# EasyEDA Pro project ProPrj_ATC PTT v1_2026-08-08.epro

# Schematic Schematic1
Board Name: Board1; Create Date: 2026-07-08; Page Name: P1; Project Name: ATC PTT v1; Schematic Name: Schematic1; Update Date: 2026-07-08; Company: EasyEDA.com; Page Size: A4; Version: V1.0
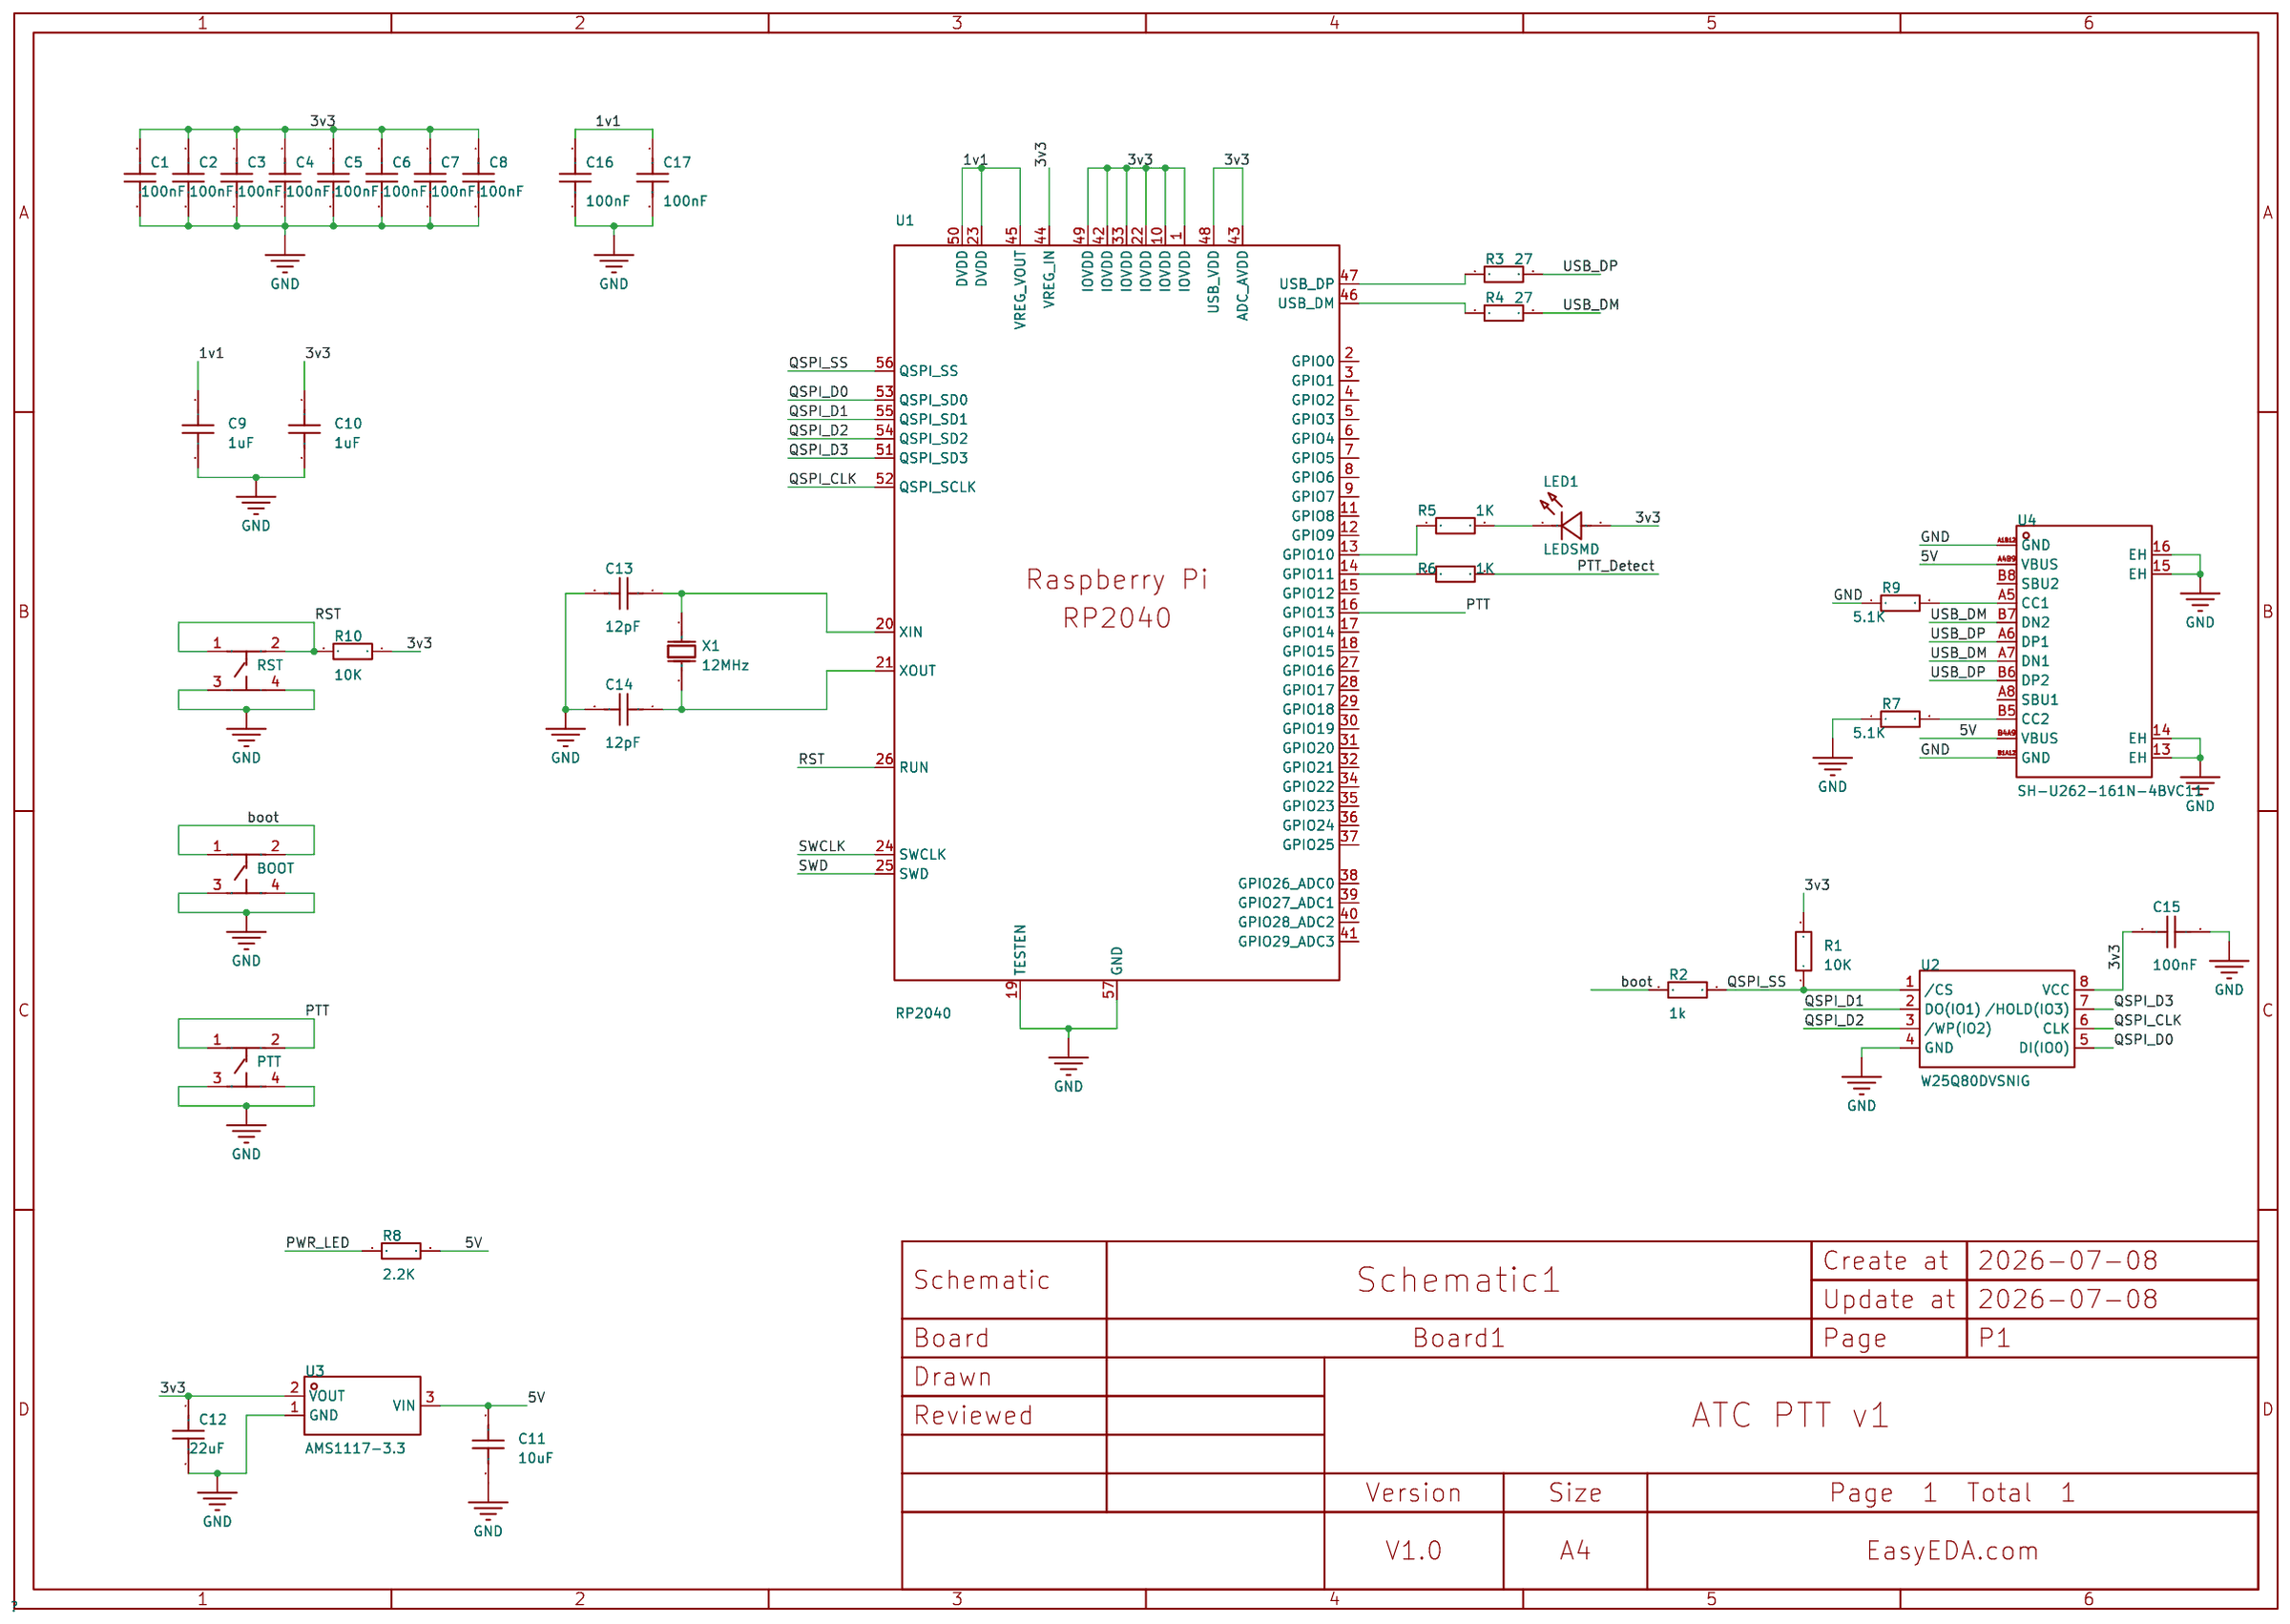
[diagram p0: schematic sheet]

## Parts
BOOT  TSD003B06018A03  [SW-SMD_4P-L6.0-W6.0-P4.50-LS8.6]
C1  100nF  [C0805]
C2  100nF  [C0805]
C3  100nF  [C0805]
C4  100nF  [C0805]
C5  100nF  [C0805]
C6  100nF  [C0805]
C7  100nF  [C0805]
C8  100nF  [C0805]
C9  1uF  [C0805]
C10  1uF  [C0805]
C11  10uF  [C0805]
C12  22uF  [C0805]
C13  12pF  [C0805]
C14  12pF  [C0805]
C15  100nF  [C0805]
C16  100nF  [C0805]
C17  100nF  [C0805]
LED1  LEDSMD  [LED0805-RD_YELLOW]
PTT  TSD003B06018A03  [SW-SMD_4P-L6.0-W6.0-P4.50-LS8.6]
R1  10K  [R0805]
R2  1k  [R0805]
R3  27  [R0805]
R4  27  [R0805]
R5  1K  [R0805]
R6  1K  [R0805]
R7  5.1K  [R0805]
R8  2.2K  [R0805]
R9  5.1K  [R0805]
R10  10K  [R0805]
RST  TSD003B06018A03  [SW-SMD_4P-L6.0-W6.0-P4.50-LS8.6]
U1  RP2040  [LQFN-56_L7.0-W7.0-P0.4-EP]
U2  W25Q80DVSNIG  [SOIC-8_L4.9-W3.9-P1.27-LS6.0-BL]
U3  AMS1117-3.3  [SOT-223-3_L6.5-W3.4-P2.30-LS7.0-BR-1]
U4  SH-U262-161N-4BVC11  [USB-3.1-SMD_U262-161N-4BVC11]
X1  12MHz  [HC-49S_L11.4-W4.8]

## Library data of the parts
BOOT PTT RST = TSD003B06018A03: Actuator Style:Round Button Operating Force:1.8N Mounting Type:Surface Mount,Vertical Length:6mm Width:6mm Switch Height:6mm Contact Current:50mA Voltage Rating:12V Life:-; LCSC Part Name: 6*6*6H-JaT 180gf 铜盖; Supplier Part: C2888774; Manufacturer: BZCN(博众电气); Supplier Footprint: SMD-4P,6x6mm; JLCPCB Part Class: Extended Part; Datasheet: https://item.szlcsc.com/datasheet/TSD003B06018A03/3109177.html; Supplier: LCSC; Actuator Style: Round Button; Operating Force: 1.8N; Mounting Type: Surface Mount,Vertical; Length: 6mm; Width: 6mm; Switch Height: 6mm; Contact Current: 50mA; Voltage Rating: 12V
C1-C17 = CAP_0603: Supplier Footprint: 0603
LED1 = YLED0805Y: Lamp Holder Type:- Illumination Color:Yellow Voltage - Forward(Vf):1.8V~2.4V Voltage - Forward(Vf):1.8V~2.4V Power(Watts):60mW Forward Current:20mA Wavelength - Dominant:584nm~596nm Wavelength - Dominant:584nm~596nm Peak Wavelength:598nm Peak Wavelength:5; LCSC Part Name: 发光管; Supplier Part: C20608785; Manufacturer: YONGYUTAI(永裕泰); Supplier Footprint: 0805; JLCPCB Part Class: Extended Part; Datasheet: https://item.szlcsc.com/datasheet/YLED0805Y/21958292.html; Supplier: LCSC; Illumination Color: Yellow; Voltage - Forward(Vf): 1.8V~2.4V; Power(Watts): 60mW; Forward Current: 20mA; Wavelength - Dominant: 584nm~596nm; Peak Wavelength: 598nm; Diode Configuration: Discrete Diode; Lens Color: Water Clear; Luminous Intensity: 210mcd; Viewing Angle: 120°; Operating Temperature: -40℃~+85℃
R1-R10 = Res_0603: Supplier Footprint: 0603
U1 = RP2040_C2040: CPU Core:- CPU Maximum Speed:133MHz Number of I/O:30 ADC (Bit):12bit; LCSC Part Name: RP2040（RP2B2）; Supplier Part: C2040; Manufacturer: Raspberry Pi(树莓派); Supplier Footprint: LQFN-56(7x7); JLCPCB Part Class: Extended Part; Datasheet: https://item.szlcsc.com/datasheet/RP2040/2392.html; Supplier: LCSC; CPU Maximum Speed: 133MHz; Number of I/O: 30; ADC (Bit): 12bit
U2 = W25Q80DVSNIG: Interface:SPI Memory Size:8Mbit Clock Frequency:104MHz Voltage - Supply:2.7V~3.6V Voltage - Supply:2.7V~3.6V Standby Supply Current:10uA Program / Erase Cycles:100,000 cycles Write Cycle Time (tWC):- Page Programming Time (Tpp):3ms Block Erase Time(tBE):-; LCSC Part Name: 支持双路和四路SPI接口的2.5V和3V、8Mbit 串行SPI闪存; Supplier Part: C115408; Manufacturer: Winbond(华邦); Supplier Footprint: SOIC-8; JLCPCB Part Class: Extended Part; Datasheet: https://item.szlcsc.com/datasheet/W25Q80DVSNIG/116656.html; Supplier: LCSC; Interface: SPI; Memory Size: 8Mbit; Clock Frequency: 104MHz; Voltage - Supply: 2.7V~3.6V; Standby Supply Current: 10uA; Program / Erase Cycles: 100,000 cycles; Page Programming Time (Tpp): 3ms; Data Retention - TDR (Year): 20 Years; Operating Temperature: -40℃~+85℃; Features: Hardware write protection；Absolute write protection；Write enable latch；Software write protection；Power lock protection
U3 = AMS1117-3.3_C22459274: Output Configuration:Positive Voltage - Supply:12V Output Voltage:3.3V Output Voltage:3.3V Output Current:1A Power Supply Rejection Ratio (PSRR):70dB@(120Hz) Voltage Dropout:1.4V@(1A) standby current:- Noise:- Features:Thermal shutdown；Over Current Protec; LCSC Part Name: 3.3V 1A 12V; Supplier Part: C22459274; Manufacturer: 晶扬电子; Supplier Footprint: SOT-223; JLCPCB Part Class: Extended Part; Datasheet: https://item.szlcsc.com/datasheet/AMS1117-3.3/24135194.html; Supplier: LCSC; Output Configuration: Positive; Voltage - Supply: 12V; Output Voltage: 3.3V; Output Current: 1A; Power Supply Rejection Ratio (PSRR): 70dB@(120Hz); Voltage Dropout: 1.4V@(1A); Features: Thermal shutdown；Over Current Protection; Operating Temperature: -40℃~+125℃@(Tj); Output Type: Fixed; Number of Outputs: 1
U4 = SH-U262-161N-4BVC11: Connector Type:Type-C Gender:Female Mounting Type:Surface Mount, Right Angle Number of Contacts:16P Number of Ports:1 Current Rating-Power:3A Voltage Rating:5V Connect-Disconnect Life:10,000 cycles Length:7.35mm Operating Temperature:-25℃~+85℃ Operating T; LCSC Part Name: 16P卧贴母座; Supplier Part: C22383468; Manufacturer: SHOU HAN(首韩); Supplier Footprint: SMD; JLCPCB Part Class: Extended Part; Datasheet: https://item.szlcsc.com/datasheet/SH-U262-161N-4BVC11/23926532.html; Supplier: LCSC; Connector Type: Type-C; Gender: Female; Mounting Type: Surface Mount, Right Angle; Number of Contacts: 16P; Number of Ports: 1; Current Rating-Power: 3A; Voltage Rating: 5V; Connect-Disconnect Life: 10,000 cycles; Length: 7.35mm; Operating Temperature: -25℃~+85℃
X1 = X49SM12MSD2SC: Type:Crystal Oscillator Frequency:12MHz Normal temperature Frequency Tolerance:±20ppm Normal temperature Frequency Tolerance:±20ppm Load Capacitance:20pF Frequency Stability:±30ppm Frequency Stability:±30ppm Operating Temperature:-20℃~+70℃ Operating Tempe; LCSC Part Name: HC-49SMD 12MHZ 20PF ±20PPM -20~70℃（±30PPM）; Supplier Part: C14871; Manufacturer: YXC(扬兴晶振); Supplier Footprint: HC-49S-SMD; JLCPCB Part Class: Extended Part; Datasheet: https://item.szlcsc.com/datasheet/X49SM12MSD2SC/15543.html; Supplier: LCSC; Type: Crystal Oscillator; Normal temperature Frequency Tolerance: ±20ppm; Load Capacitance: 20pF; Frequency Stability: ±30ppm; Operating Temperature: -20℃~+70℃

## Nets
1v1: C9.1 C16.1 C17.1 U1.23(DVDD) U1.45(VREG_VOUT) U1.50(DVDD)
3v3: C1.1 C2.1 C3.1 C4.1 C5.1 C6.1 C7.1 C8.1 C10.1 C12.1 C15.2 LED1.2(A) R1.2 R10.1 U1.1(IOVDD) U1.10(IOVDD) U1.22(IOVDD) U1.33(IOVDD) U1.42(IOVDD) U1.43(ADC_AVDD) U1.44(VREG_IN) U1.48(USB_VDD) U1.49(IOVDD) U2.8(VCC) U3.2(VOUT)
5V: C11.1 R8.2 U3.3(VIN) U4.A4B9(VBUS) U4.B4A9(VBUS)
GND: BOOT.3 BOOT.4 C1.2 C2.2 C3.2 C4.2 C5.2 C6.2 C7.2 C8.2 C9.2 C10.2 C11.2 C12.2 C13.2 C14.2 C15.1 C16.2 C17.2 PTT.3 PTT.4 R7.1 R9.1 RST.3 RST.4 U1.19(TESTEN) U1.57(GND) U2.4(GND) U3.1(GND) U4.13(EH) U4.14(EH) U4.15(EH) U4.16(EH) U4.A1B12(GND) U4.B1A12(GND)
boot: BOOT.1 BOOT.2 R2.2
PTT: PTT.1 PTT.2 U1.16(GPIO13)
PTT_Detect: R6.2
PWR_LED: R8.1
QSPI_CLK: U1.52(QSPI_SCLK) U2.6(CLK)
QSPI_D0: U1.53(QSPI_SD0) U2.5(DI(IO0))
QSPI_D1: U1.55(QSPI_SD1) U2.2(DO(IO1))
QSPI_D2: U1.54(QSPI_SD2) U2.3(/WP(IO2))
QSPI_D3: U1.51(QSPI_SD3) U2.7(/HOLD(IO3))
QSPI_SS: R1.1 R2.1 U1.56(QSPI_SS) U2.1(/CS)
RST: R10.2 RST.1 RST.2 U1.26(RUN)
SWCLK: U1.24(SWCLK)
SWD: U1.25(SWD)
USB_DM: R4.2 U4.A7(DN1) U4.B7(DN2)
USB_DP: R3.2 U4.A6(DP1) U4.B6(DP2)
$1N4: R3.1 U1.47(USB_DP)
$1N5: R4.1 U1.46(USB_DM)
$1N60: R5.1 U1.13(GPIO10)
$1N61: R6.1 U1.14(GPIO11)
$1N62: C13.1 U1.20(XIN) X1.1(OSC1)
$1N65: C14.1 U1.21(XOUT) X1.2(OSC2)
$1N67: LED1.1(K) R5.2
$1N84: R9.2 U4.A5(CC1)
$1N85: R7.2 U4.B5(CC2)

Not connected (* = marked no-connect by the designer): U1 2(GPIO0) 3(GPIO1) 4(GPIO2) 5(GPIO3) 6(GPIO4) 7(GPIO5) 8(GPIO6) 9(GPIO7) 11(GPIO8) 12(GPIO9) 15(GPIO12) 17(GPIO14) 18(GPIO15) 27(GPIO16) 28(GPIO17) 29(GPIO18) 30(GPIO19) 31(GPIO20) 32(GPIO21) 34(GPIO22) 35(GPIO23) 36(GPIO24) 37(GPIO25) 38(GPIO26_ADC0) 39(GPIO27_ADC1) 40(GPIO28_ADC2) 41(GPIO29_ADC3); U4 A8(SBU1) B8(SBU2)

# Board PCB1
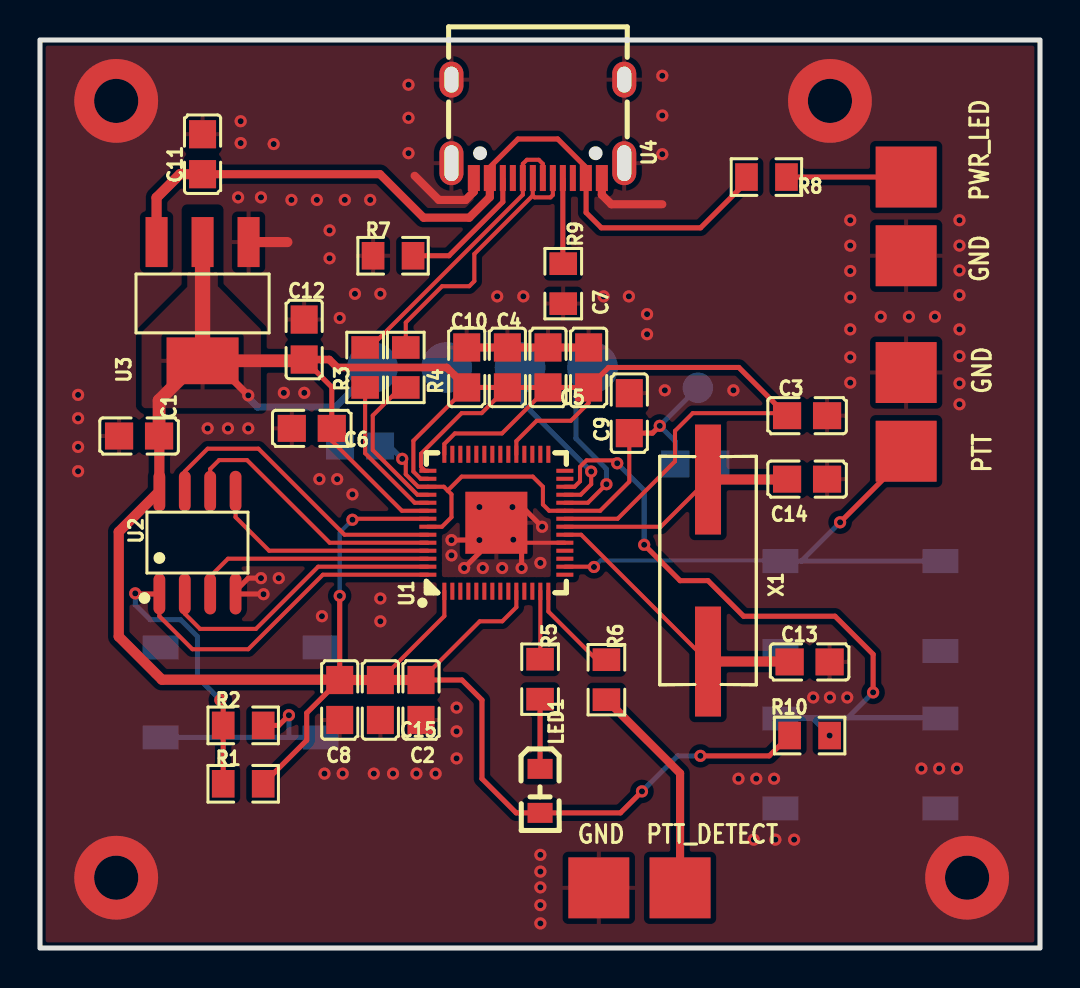
[diagram p1: board, top side]
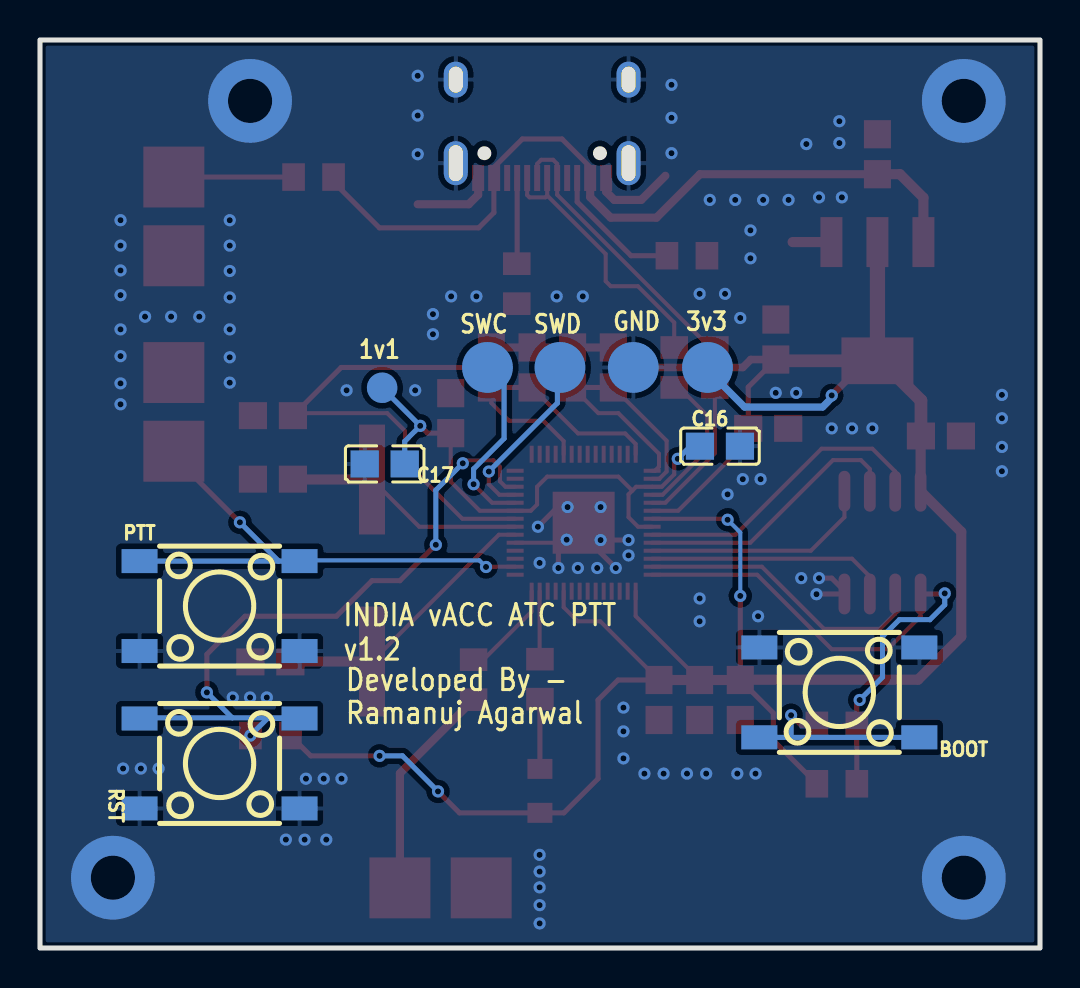
[diagram p2: board, bottom side, seen from below]

Outline 50 x 45.43 mm; copper layers: Top Layer, Bottom Layer. Coordinates in mm from the lower left corner of the outline.
Outline path: rectangle 0,45.43 50,0
Stack: Top Layer 0.035mm / Dielectric1 1.51mm FR4 er 4.5 / Bottom Layer 0.035mm

## Design rules (mm)
net $1N4: DP1
net $1N5: DP1
spacing copperThickness1oz (default): track to track 0.102, other pairs 0.152 to 0.3
spacing copperThickness2oz: track to track 0.203, other pairs 0.152 to 0.3
track width copperThickness1oz (default): min 0.127, default 0.254, max 2.54
track width copperThickness2oz: min 0.203, default 0.254, max 2.54
differential pair differentialPair (default): width min 0.127, default 0.254, max 2.54; gap min 0.152, default 0.152
net 3V3 uses copperRegion
net GND uses copperRegion

## Placement (name value [footprint] x y rotation side)
BOOT  TSD003B06018A03  [SW-SMD_4P-L6.0-W6.0-P4.50-LS8.6]  10.03 12.79 0 bottom
C1  100nF  [C0805]  4.95 25.62 180 top
C2  100nF  [C0805]  19.05 12.41 270 top
C3  100nF  [C0805]  38.35 26.63 0 top
C4  100nF  [C0805]  23.37 29.05 90 top
C5  100nF  [C0805]  25.4 29.05 90 top
C6  100nF  [C0805]  13.59 26 180 top
C7  100nF  [C0805]  27.43 29.05 90 top
C8  100nF  [C0805]  14.99 12.41 270 top
C9  1uF  [C0805]  29.46 26.76 90 top
C10  1uF  [C0805]  21.34 29.05 90 top
C11  10uF  [C0805]  8.13 39.71 90 top
C12  22uF  [C0805]  13.21 30.44 90 top
C13  12pF  [C0805]  38.48 14.31 0 top
C14  12pF  [C0805]  38.35 23.46 0 top
C15  100nF  [C0805]  17.02 12.41 90 top
C16  100nF  [C0805]  16 25.11 180 bottom
C17  100nF  [C0805]  32.77 24.22 0 bottom
LED1  LEDSMD  [LED0805-RD_YELLOW]  25 7.86 270 top
NOREF  -  [Pad_e573]  27.63 29.05 0 top
NOREF#2  -  [Pad_e262]  43.31 34.63 0 top
NOREF#3  -  [Pad_e260]  43.31 38.57 0 top
NOREF#4  -  [Pad_e585]  20.34 29.05 0 top
NOREF#5  -  [Pad_e264]  43.31 24.85 0 top
NOREF#6  -  [Pad_e587]  16.63 29.05 0 top
NOREF#7  -  [Pad_e257]  27.94 3.01 0 top
NOREF#8  -  [Pad_e572]  24 29.05 0 top
NOREF#9  -  [Pad_e652]  32.89 28.03 0 top
NOREF#10  -  [Pad_e256]  32 3.01 0 top
NOREF#11  -  [Pad_e263]  43.31 28.79 0 top
PTT  TSD003B06018A03  [SW-SMD_4P-L6.0-W6.0-P4.50-LS8.6]  41.02 17.11 180 bottom
R1  10K  [R0805]  10.16 8.22 0 top
R2  1k  [R0805]  10.16 11.14 0 top
R3  27  [R0805]  16.26 29.05 90 top
R4  27  [R0805]  18.29 29.05 90 top
R5  1K  [R0805]  25 13.45 270 top
R6  1K  [R0805]  28.32 13.42 270 top
R7  5.1K  [R0805]  17.65 34.63 0 top
R8  2.2K  [R0805]  36.32 38.57 180 top
R9  5.1K  [R0805]  26.16 33.24 90 top
R10  10K  [R0805]  38.48 10.63 0 top
RST  TSD003B06018A03  [SW-SMD_4P-L6.0-W6.0-P4.50-LS8.6]  41.02 9.23 180 bottom
U1  RP2040  [LQFN-56_L7.0-W7.0-P0.4-EP]  22.82 21.28 90 top
U2  W25Q80DVSNIG  [SOIC-8_L4.9-W3.9-P1.27-LS6.0-BL]  7.87 20.28 0 top
U3  AMS1117-3.3  [SOT-223-3_L6.5-W3.4-P2.30-LS7.0-BR-1]  8.13 32.35 90 top
U4  SH-U262-161N-4BVC11  [USB-3.1-SMD_U262-161N-4BVC11]  24.89 40.98 180 top
X1  12MHz  [HC-49S_L11.4-W4.8]  33.4 18.88 90 top

## Footprints (pads in the part's own frame, mm; a bottom-side part is the same pattern mirrored in y, then rotated)
C0805
  rect 1.41x1.35 smd: 1(-1,0) 2(1,0)
HC-49S_L11.4-W4.8
  rect 5.5x1.3 smd: 1(-4.553,0) 2(4.553,0)
LED0805-RD_YELLOW
  rect 1x1.25 smd: 1(-1.1,0) 2(1.1,0)
LQFN-56_L7.0-W7.0-P0.4-EP
  rect 0.85x0.2 smd: 1(-3.425,2.6) 2(-3.425,2.2) 3(-3.425,1.8) 4(-3.425,1.4) 5(-3.425,1) 6(-3.425,0.6) 7(-3.425,0.2) 8(-3.425,-0.2) 9(-3.425,-0.6) 10(-3.425,-1) 11(-3.425,-1.4) 12(-3.425,-1.8) 13(-3.425,-2.2) 14(-3.425,-2.6) 29(3.425,-2.6) 30(3.425,-2.2) 31(3.425,-1.8) 32(3.425,-1.4) 33(3.425,-1) 34(3.425,-0.6) 35(3.425,-0.2) 36(3.425,0.2) 37(3.425,0.6) 38(3.425,1) 39(3.425,1.4) 40(3.425,1.8) 41(3.425,2.2) 42(3.425,2.6)
  rect 0.2x0.85 smd: 15(-2.6,-3.425) 16(-2.2,-3.425) 17(-1.8,-3.425) 18(-1.4,-3.425) 19(-1,-3.425) 20(-0.6,-3.425) 21(-0.2,-3.425) 22(0.2,-3.425) 23(0.6,-3.425) 24(1,-3.425) 25(1.4,-3.425) 26(1.8,-3.425) 27(2.2,-3.425) 28(2.6,-3.425) 43(2.6,3.425) 44(2.2,3.425) 45(1.8,3.425) 46(1.4,3.425) 47(1,3.425) 48(0.6,3.425) 49(0.2,3.425) 50(-0.2,3.425) 51(-0.6,3.425) 52(-1,3.425) 53(-1.4,3.425) 54(-1.8,3.425) 55(-2.2,3.425) 56(-2.6,3.425)
  rect 3.1x3.1 smd: 57(0,0)
Pad_e256
  rect 3.048x3.048 smd: 1(0,0)
Pad_e257
  rect 3.048x3.048 smd: 2(0,0)
Pad_e260
  rect 3.048x3.048 smd: 1(0,0)
Pad_e262
  rect 3.048x3.048 smd: 1(0,0)
Pad_e263
  rect 3.048x3.048 smd: 2(0,0)
Pad_e264
  rect 3.048x3.048 smd: 2(0,0)
Pad_e572
  round 2.54 smd far side: 1(0,0)
Pad_e573
  round 2.54 smd far side: 1(0,0)
Pad_e585
  round 2.54 smd far side: 1(0,0)
Pad_e587
  round 2.54 smd far side: 1(0,0)
Pad_e652
  round 1.524 smd far side: 1(0,0)
R0805
  rect 1.133x1.377 smd: 1(-1,0) 2(1,0)
SOIC-8_L4.9-W3.9-P1.27-LS6.0-BL
  oval 0.588x2.045 smd: 1(-1.905,-2.57) 2(-0.635,-2.57) 3(0.635,-2.57) 4(1.905,-2.57) 5(1.905,2.57) 6(0.635,2.57) 7(-0.635,2.57) 8(-1.905,2.57)
SOT-223-3_L6.5-W3.4-P2.30-LS7.0-BR-1
  rect 2.5x1.1 smd: 1(2.97,-2.3) 2(2.97,0) 3(2.97,2.3)
  rect 2.34x3.6 smd: 2(-2.97,0)
SW-SMD_4P-L6.0-W6.0-P4.50-LS8.6
  rect 1.8x1.2 smd: 1(-4,2.25) 2(4,2.25) 3(-4,-2.25) 4(4,-2.25)
USB-3.1-SMD_U262-161N-4BVC11
  oval 1.2x2.2 hole 0.7x1.8: 13(4.32,1.719) 16(-4.32,1.719)
  oval 1.2x1.8 hole 0.7x1.3: 14(4.32,-2.462) 15(-4.32,-2.462)
  rect 0.6x1.3 smd: A1B12(-3.2,2.462) A4B9(-2.4,2.462) B1A12(3.2,2.462) B4A9(2.4,2.462)
  rect 0.3x1.3 smd: A5(-1.25,2.462) A6(-0.25,2.462) A7(0.25,2.462) A8(1.25,2.462) B5(1.75,2.462) B6(0.75,2.462) B7(-0.75,2.462) B8(-1.75,2.462)

## Nets
As in the schematic, except:
GND: BOOT.3 BOOT.4 C1.2 C2.2 C3.2 C4.2 C5.2 C6.2 C7.2 C8.2 C9.2 C10.2 C11.2 C12.2 C13.2 C14.2 C15.1 C16.2 C17.2 NOREF#2.1 NOREF#4.1 NOREF#7.2 NOREF#11.2 PTT.3 PTT.4 R7.1 R9.1 RST.3 RST.4 U1.19 U1.57 U2.4 U3.1 U4.13 U4.14 U4.15 U4.16 U4.A1B12 U4.B1A12
PTT: NOREF#5.2 PTT.1 PTT.2 U1.16
PTT_Detect: NOREF#10.1 R6.2
PWR_LED: NOREF#3.1 R8.1
SWCLK: NOREF.1 U1.24
SWD: NOREF#8.1 U1.25

Pads without a net: U1 2 3 4 5 6 7 8 9 11 12 15 17 18 27 28 29 30 31 32 34 35 36 37 38 39 40 41; U4 A8 B8

## Via types
v1: diameter 0.61, hole 0.305, Top Layer to Bottom Layer, 120 vias
v2: diameter 4.191, hole 2.21, Top Layer to Bottom Layer, 4 vias

## Routing (per net, layer and track width the routed paths; a pad name or vN(x,y) marks a point on that pad's centre or on a via; arc(x,y) is an arc through that point)
1V1: length 24
  Top Layer w0.203: 18.11,24.47 18.29,24.3 18.29,23.7 18.91,23.08 19.39,23.08 20.19,23.08 20.38,22.89 ; 29.46,25.76 29.46,23.33 28.01,21.88 26.24,21.88 25.46,21.88 25.15,22.19 25.15,23.08 24.64,23.58 21.08,23.58 20.38,22.89 ; 20.38,22.89 20.57,22.69 20.57,21.55 20.1,21.08 19.39,21.08
  Top Layer w0.254: v1(30.99,26.12) 30.62,25.76 29.46,25.76
  Bottom Layer w0.254: v1(30.99,26.12) 32.82,27.96
1v1: length 3.6
  Bottom Layer w0.254: C16.1 17.48,25.11 v1(18.11,24.47) ; C17.1 31.77,25.35 30.99,26.12
3V3: length 91.2
  Top Layer w0.203: 21.08,26.76 19.05,24.73 19.05,24.08 19.25,23.88 19.39,23.88 ; 23.82,17.85 23.82,17.05 23.11,16.34 21.99,16.34 ; 27.43,28.05 27.43,27.27 26.54,26.38 24.83,26.38 ; 20.22,16.61 20.22,17.85 ; 28.88,21.48 31.75,24.35 ; 14.59,26 14.59,25.38 18.09,21.88 ; 19.03,23.48 18.67,23.84 18.67,25.38 21.34,28.05 ; 15.62,21.42 15.67,21.48 19.39,21.48
  Top Layer w0.254: 13.34,10.39 13.34,11.76 ; 33.02,9.61 36.47,9.61 37.48,10.63 ; 37.35,26.63 34.94,29.05 28.43,29.05 ; 14.99,13.55 14.99,17.61 ; 14.59,28.06 14.59,26
  Top Layer w0.381: 14.46,29.44 14.86,29.05 20.34,29.05 21.34,28.05
  Top Layer w0.508: 3.94,15.58 6.1,13.42 14.86,13.42 14.99,13.55
  Top Layer w0.635: 8.13,29.38 13.14,29.38
  Top Layer w0.762: 8.13,35.32 8.13,29.38
  Bottom Layer w0.355: 10.41,27.65 10.41,27.52 10.87,27.06 14.77,27.06 16.63,28.92 NOREF#6.1
3v3: length 94.7
  Top Layer w0.203: C15.2 20.22,16.61 ; U1.33 23.82,25.36 24.83,26.38 ; U1.48 18.09,21.88 ; 21.08,26.76 22.08,26.76 C4.1 ; U1.22 28.88,21.48 ; C5.1 23.1,25.74 20.74,25.74 20.22,25.22 U1.42 ; 19.03,23.48 U1.44 ; 37.23,26.76 32.64,26.76 31.75,25.87 31.75,24.35 ; C2.1 21.99,16.34
  Top Layer w0.254: C12.1 14.59,28.06 ; 13.34,11.76 C8.1 ; C2.1 21.1,13.41 22.1,12.41 22.1,8.47 23.81,6.76 LED1.2 29.02,6.76 v1(30.1,7.84) ; C10.1 C4.1 C5.1 C7.1 28.43,29.05 ; R1.2 13.34,10.39
  Top Layer w0.355: 8.69,29.38 v1(10.41,27.65)
  Top Layer w0.381: C12.1 14.46,29.44
  Top Layer w0.508: C1.1 5.97,25.6 U2.8 3.94,20.82 3.94,15.58 ; C2.1 C15.2 C8.1
  Top Layer w0.635: C1.1 5.95,27.39 8.03,29.47 ; 13.14,29.38 C12.1
  Bottom Layer w0.203: v1(15.62,21.42) 14.99,20.79 v1(14.99,17.61)
  Bottom Layer w0.254: v1(30.1,7.84) 31.88,9.61 v1(33.02,9.61)
5V: length 40.1
  Top Layer w0.254: 35.57,38.57 33.03,36.03 28.07,36.03 27.31,36.79 27.31,38.51 U4.A4B9 27.31,38.53 27.31,39.05 25.88,40.47 23.9,40.47 22.48,39.05 22.48,38.53 U4.B4A9
  Top Layer w0.406: C11.1 17,38.71 19.18,36.54 21.46,36.54 22.49,37.57 U4.B4A9
  Top Layer w0.508: C11.1 7,38.71 5.83,37.54 U3.3
GND: length 29.5
  Top Layer w0.203: 23.82,20.28 U1.19 ; v1(23.67,20.43) U1.57
  Top Layer w0.254: v1(24.08,19.01) 24.08,20.01 23.82,20.28 ; v1(25.1,21.07) 24.12,22.06 v1(23.62,22.06) ; v1(21.21,19.01) 21.97,19.77 v1(21.97,20.41) v1(20.57,20.41) ; v1(11.18,17.7) 11.16,17.71 U2.4 9.78,17.87 10.41,18.5 v1(11.05,18.5)
  Top Layer w0.406: 31.12,37.21 28.56,37.21 28.09,37.68 U4.A1B12 ; C7.2 C5.2 C4.2 C10.2 ; U4.B1A12 21.69,37.83 21.29,37.43 19.94,37.43 18.73,38.63
  Top Layer w0.508: U3.1 12.37,35.32
  vias: v1(1.91,27.67) v1(1.91,26.5) v1(1.91,25.07) v1(1.91,23.85) v1(8.38,26) v1(9.4,26) v1(9.91,37.55) v1(10.03,41.36) v1(10.03,40.27) v1(10.41,26) v1(11.05,37.55) v1(11.68,40.22) v1(11.94,18.5) v1(12.19,27.77) v1(12.57,37.43) v1(13.21,27.77) v1(13.84,37.43) v1(13.97,23.46) v1(14.1,16.6) v1(14.22,8.72) v1(14.48,35.9) v1(14.48,34.51) v1(14.86,23.46) v1(14.99,31.52) v1(15.13,8.72) v1(15.24,37.43) v1(15.62,22.69) v1(15.75,32.73) v1(16.51,37.43) v1(16.69,8.72) v1(17.02,32.73) v1(17.02,17.49) v1(17.02,16.34) v1(17.65,8.72) v1(18.43,43.19) v1(18.43,41.53) v1(18.43,39.76) v1(18.82,8.72) v1(19.78,8.72) v1(20.57,19.64) v1(20.83,12.03) v1(20.83,10.84) v1(20.83,9.49) v1(21.97,22.06) v1(22.14,19.01) v1(22.86,32.6) v1(23.11,19.01) v1(24.17,32.6) v1(25.02,19.27) v1(25.02,4.66) v1(25.02,3.82) v1(25.02,3.03) v1(25.02,2.15) v1(25.02,1.23) v1(28.18,32.6) v1(29.44,32.6) v1(30.35,31.71) v1(30.35,30.71) v1(31.12,43.64) v1(31.12,41.65) v1(31.12,39.71) v1(31.24,27.9) v1(34.67,27.9) v1(34.93,8.47) v1(35.69,5.42) v1(35.81,8.47) v1(36.7,8.47) v1(36.77,5.42) v1(37.71,5.42) v1(38.66,12.53) v1(39.5,12.53) v1(40.36,12.53) v1(40.51,36.41) v1(40.51,35.14) v1(40.51,33.87) v1(40.51,32.55) v1(40.51,30.95) v1(40.51,29.55) v1(40.51,28.28) v1(42.04,31.58) v1(43.45,31.58) v1(44.07,8.98) v1(44.75,31.58) v1(44.96,8.98) v1(45.85,8.98) v1(45.97,36.41) v1(45.97,35.14) v1(45.97,33.9) v1(45.97,32.66) v1(45.97,30.95) v1(45.97,29.61) v1(45.97,28.25) v1(45.97,27.2) v2(3.81,42.38) v2(3.81,3.52) v2(39.5,42.38) v2(46.35,3.52)
BOOT: length 9.1
  Bottom Layer w0.254: 12.49,10.54 6.03,10.54 ; 12.49,10.54 14.03,10.54 ; 12.49,10.54 12.45,10.58 12.45,11.65
boot: length 1.5
  Top Layer w0.254: v1(12.45,11.65) 11.94,11.14 R2.2
PTT: length 26.6
  Top Layer w0.203: U1.16 27.69,19.08 v1(27.7,19.06)
  Top Layer w0.254: v1(40,21.3) 43.31,24.6 NOREF#5.2
  Bottom Layer w0.203: v1(27.7,19.06) 28.03,19.39 36.99,19.39 PTT.2
  Bottom Layer w0.254: PTT.1 38.06,19.36 ; 38.06,19.36 v1(40,21.3) ; 38.06,19.36 PTT.2
PTT_Detect: length 11.3
  Top Layer w0.406: R6.2 32,8.74 32,2.63
PWR_LED: length 6
  Top Layer w0.254: R8.1 NOREF#3.1
QSPI_CLK: length 13.9
  Top Layer w0.203: U1.52 14.48,20.28 10.35,24.41 8.95,24.41 8.51,23.97 U2.6
QSPI_D0: length 11.6
  Top Layer w0.203: U2.5 9.78,21.55 11.46,19.88 U1.53
QSPI_D1: length 14.7
  Top Layer w0.203: U1.55 13.91,19.08 10.79,15.96 8,15.96 7.24,16.73 7.24,17.71
QSPI_D2: length 12.1
  Top Layer w0.203: U2.3 8.51,18.59 9.4,19.48 U1.54
QSPI_D3: length 15.4
  Top Layer w0.203: 7.24,22.85 7.24,23.84 8.38,24.98 10.92,24.98 15.23,20.68 U1.51
QSPI_SS: length 30.2
  Top Layer w0.203: U2.1 5.97,16.6 7.62,14.95 10.41,14.95 14.14,18.68 U1.56
  Top Layer w0.254: R1.1 R2.1 9.16,12.27 v1(9.02,12.41) ; U2.1 4.79,17.71 v1(4.76,17.74)
  Bottom Layer w0.254: v1(9.02,12.41) 7.87,13.55 7.87,15.58 7.03,16.43 5.51,16.43 4.76,17.17 v1(4.76,17.74)
RST: length 37.3
  Top Layer w0.203: U1.26 26.73,23.08 27,23.35 27,24.07 27.33,24.4 28.72,24.4 v1(28.86,24.25)
  Top Layer w0.254: v1(41.66,12.79) 41.66,14.69 39.75,16.6 35.18,16.6 33.4,18.38 32,18.38 v1(30.21,20.17)
  Bottom Layer w0.254: v1(39.48,10.63) 38.63,11.48 RST.2 ; 36.45,11.14 36.83,11.52 40.39,11.52 ; 40.39,11.52 44.99,11.52 RST.1 ; 40.39,11.52 v1(41.66,12.79) ; v1(30.21,20.17) 30.21,22.9 v1(28.86,24.25)
SWCLK: length 9.3
  Top Layer w0.203: U1.24 27.39,22.28 v1(28.32,23.2)
  Bottom Layer w0.254: NOREF.1 26.8,28.21 26.8,25.49 28.32,23.97 v1(28.32,23.2)
SWD: length 8.8
  Top Layer w0.203: v1(27.56,23.84) 27.56,23.2 27.03,22.68 U1.25
  Bottom Layer w0.254: v1(27.56,23.84) 24.13,27.27 24.13,29.05
USB_DM: length 13.8
  Top Layer w0.203: U4.A7 24.64,38.52 24.64,37.64 ; 24.64,37.64 24.73,37.55 25.53,37.55 25.64,37.67 U4.B7 ; 24.64,37.64 21.72,34.72 21.72,33.36 21.46,33.11 20.1,33.11 18.29,31.29 R4.2
USB_DP: length 14.5
  Top Layer w0.203: U4.A6 25.14,39.23 24.94,39.43 24.34,39.43 24.14,39.23 U4.B6 24.14,37.68 16.5,30.05 R3.2
$1N4: length 7.7
  Top Layer w0.203: U1.47 18.73,22.28 16.26,24.75 16.26,28.29
$1N5: length 7.7
  Top Layer w0.203: 18.29,28.29 16.64,26.64 16.64,24.91 18.87,22.68 U1.46
$1N60: length 3.7
  Top Layer w0.203: 25,14.2 25.02,14.22 U1.13
$1N61: length 4.9
  Top Layer w0.203: U1.14 25.42,16.84 27.83,14.42 R6.1
$1N62: length 14.2
  Top Layer w0.203: U1.20 27.06,20.68 X1.1
  Top Layer w0.508: 37.78,14.31 37.76,14.33 X1.1
$1N65: length 12.4
  Top Layer w0.203: U1.21 31.04,21.08 X1.2
  Top Layer w0.508: X1.2 37.63,23.44 37.65,23.46
$1N67: length 3.7
  Top Layer w0.254: 25,12.7 LED1.1
$1N84: length 4.3
  Top Layer w0.254: R9.2 26.14,34.26 U4.A5
$1N85: length 7
  Top Layer w0.254: U4.B5 23.14,37.33 20.45,34.63 18.41,34.63

## Copper pours and planes (outline as drawn; the poured copper is in the pictures)
3v3 on Top Layer: 7.37,36.92 8.89,36.92 8.89,33.11 11.05,30.95 11.05,27.01 5.21,27.01 5.08,27.14 5.08,30.8 7.36,33.08 7.36,36.92
GND on Top Layer: -3.43,49.36 53.47,49.36 53.47,-2.96 -3.43,-2.96
GND on Bottom Layer: -1.4,46.83 52.32,46.83 52.32,-7.53 -1.4,-7.53

## Text on the board
Bottom Silkscreen Layer: 3v3 | GND | SWD | SWC | 1v1 | Developed By - | Ramanuj Agarwal | INDIA vACC ATC PTT / v1.2
Top Silkscreen Layer: GND | PTT_DETECT | PWR_LED | PTT
